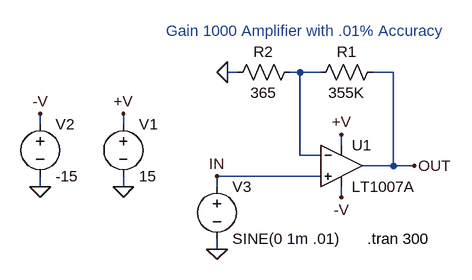
[diagram p0: schematic 1007A.asc]
1007A.asc, the LTspice schematic file:
Version 4
SHEET 1 896 680
WIRE 32 96 16 96
WIRE 128 96 112 96
WIRE 160 96 128 96
WIRE 272 96 240 96
WIRE -272 176 -272 160
WIRE -144 176 -144 160
WIRE 192 208 192 192
WIRE 128 224 128 96
WIRE 160 224 128 224
WIRE 272 240 272 96
WIRE 272 240 224 240
WIRE 304 240 272 240
WIRE 160 256 0 256
WIRE -272 272 -272 256
WIRE -144 272 -144 256
WIRE 0 272 0 256
WIRE 192 288 192 272
WIRE 0 368 0 352
FLAG -144 272 0
FLAG 192 192 +V
FLAG -144 160 +V
FLAG 192 288 -V
FLAG -272 272 0
FLAG -272 160 -V
FLAG 16 96 0
FLAG 0 368 0
FLAG 304 240 OUT
FLAG 0 256 IN
SYMBOL voltage -144 160 R0
SYMATTR InstName V1
SYMATTR Value 15
SYMBOL voltage -272 160 R0
SYMATTR InstName V2
SYMATTR Value -15
SYMBOL res 256 80 R90
WINDOW 0 0 56 VBottom 0
WINDOW 3 32 56 VTop 0
SYMATTR InstName R1
SYMATTR Value 355K
SYMBOL res 128 80 R90
WINDOW 0 0 56 VBottom 0
WINDOW 3 32 56 VTop 0
SYMATTR InstName R2
SYMATTR Value 365
SYMBOL voltage 0 256 R0
SYMATTR InstName V3
SYMATTR Value SINE(0 1m .01)
SYMBOL opamps\\LT1007A 192 176 R0
SYMATTR InstName U1
TEXT 232 352 Left 0 !.tran 300
TEXT 136 48 Bottom 0 ;Gain 1000 Amplifier with .01% Accuracy

The netlist it stands for:
* 1007A.asc
V1 +V 0 15
V2 -V 0 -15
R1 OUT N001 355K
R2 N001 0 365
V3 IN 0 SINE(0 1m .01)
XU1 IN N001 +V -V OUT LT1007A  ; pins In+ In- V+ V- OUT
.tran 300
* Gain 1000 Amplifier with .01% Accuracy
.backanno
.end